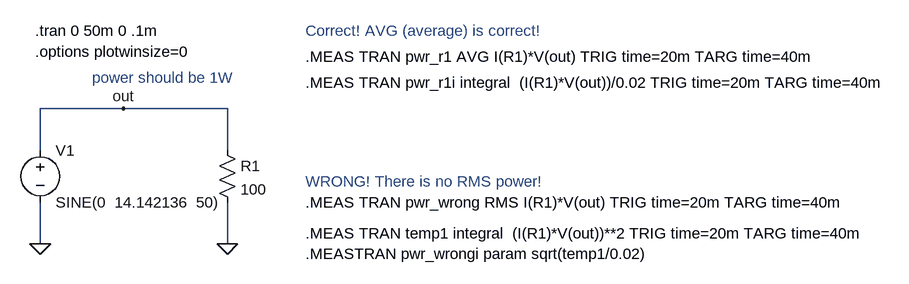
[diagram p0: schematic power_avg1.asc]
power_avg1.asc, the LTspice schematic file:
Version 4
SHEET 1 1620 680
WIRE 80 192 -48 192
WIRE 240 192 80 192
WIRE -48 256 -48 192
WIRE 240 256 240 192
WIRE -48 400 -48 336
WIRE 240 400 240 336
FLAG -48 400 0
FLAG 240 400 0
FLAG 80 192 out
SYMBOL voltage -48 240 R0
WINDOW 123 0 0 Left 0
WINDOW 39 0 0 Left 0
SYMATTR InstName V1
SYMATTR Value SINE(0  14.142136  50)
SYMBOL res 224 240 R0
SYMATTR InstName R1
SYMATTR Value 100
TEXT -56 72 Left 0 !.tran 0 50m 0 .1m
TEXT -56 104 Left 0 !.options plotwinsize=0
TEXT 360 336 Left 0 !.MEAS TRAN pwr_wrong RMS I(R1)*V(out) TRIG time=20m TARG time=40m
TEXT 360 112 Left 0 !.MEAS TRAN pwr_r1 AVG I(R1)*V(out) TRIG time=20m TARG time=40m
TEXT 32 144 Left 0 ;power should be 1W
TEXT 360 304 Left 0 ;WRONG! There is no RMS power!
TEXT 360 72 Left 0 ;Correct! AVG (average) is correct!
TEXT 360 384 Left 0 !.MEAS TRAN temp1 integral  (I(R1)*V(out))**2 TRIG time=20m TARG time=40m\n.MEASTRAN pwr_wrongi param sqrt(temp1/0.02)
TEXT 360 152 Left 0 !.MEAS TRAN pwr_r1i integral  (I(R1)*V(out))/0.02 TRIG time=20m TARG time=40m

The netlist it stands for:
* power_avg1.asc
V1 out 0 SINE(0  14.142136  50)
R1 out 0 100
.tran 0 50m 0 .1m
.options plotwinsize=0
.MEAS TRAN pwr_wrong RMS I(R1)*V(out) TRIG time=20m TARG time=40m
.MEAS TRAN pwr_r1 AVG I(R1)*V(out) TRIG time=20m TARG time=40m
* power should be 1W
* WRONG! There is no RMS power!
* Correct! AVG (average) is correct!
.MEAS TRAN temp1 integral  (I(R1)*V(out))**2 TRIG time=20m TARG time=40m
.MEASTRAN pwr_wrongi param sqrt(temp1/0.02)
.MEAS TRAN pwr_r1i integral  (I(R1)*V(out))/0.02 TRIG time=20m TARG time=40m
.backanno
.end